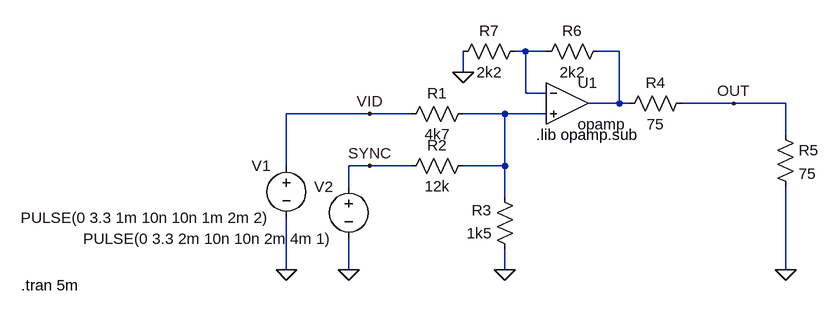
[diagram p0: schematic Video_Out.asc]
Video_Out.asc, the LTspice schematic file:
Version 4
SHEET 1 888 680
WIRE 432 -96 416 -96
WIRE 464 -96 432 -96
WIRE 576 -96 544 -96
WIRE 336 -64 336 -96
WIRE 432 -32 432 -96
WIRE 464 -32 432 -32
WIRE 576 -16 576 -96
WIRE 576 -16 528 -16
WIRE 592 -16 576 -16
WIRE 752 -16 672 -16
WIRE 832 -16 752 -16
WIRE 192 0 64 0
WIRE 256 0 192 0
WIRE 400 0 336 0
WIRE 464 0 400 0
WIRE 832 32 832 -16
WIRE 64 80 64 0
WIRE 192 80 160 80
WIRE 256 80 192 80
WIRE 400 80 400 0
WIRE 400 80 336 80
WIRE 160 112 160 80
WIRE 400 128 400 80
WIRE 64 240 64 160
WIRE 160 240 160 192
WIRE 400 240 400 208
WIRE 832 240 832 112
FLAG 64 240 0
FLAG 160 240 0
FLAG 400 240 0
FLAG 192 80 SYNC
FLAG 192 0 VID
FLAG 752 -16 OUT
FLAG 832 240 0
FLAG 336 -64 0
SYMBOL voltage 64 64 M0
WINDOW 123 0 0 Left 2
WINDOW 39 0 0 Left 2
SYMATTR InstName V1
SYMATTR Value PULSE(0 3.3 1m 10n 10n 1m 2m 2)
SYMBOL voltage 160 96 M0
WINDOW 123 0 0 Left 2
WINDOW 39 0 0 Left 2
SYMATTR InstName V2
SYMATTR Value PULSE(0 3.3 2m 10n 10n 2m 4m 1)
SYMBOL res 352 -16 R90
WINDOW 0 0 56 VBottom 2
WINDOW 3 32 56 VTop 2
SYMATTR InstName R1
SYMATTR Value 4k7
SYMBOL res 352 64 R90
WINDOW 0 0 56 VBottom 2
WINDOW 3 32 56 VTop 2
SYMATTR InstName R2
SYMATTR Value 12k
SYMBOL res 416 224 R180
WINDOW 0 36 76 Left 2
WINDOW 3 36 40 Left 2
SYMATTR InstName R3
SYMATTR Value 1k5
SYMBOL Opamps\\opamp 496 -80 R0
SYMATTR InstName U1
SYMBOL res 688 -32 R90
WINDOW 0 0 56 VBottom 2
WINDOW 3 32 56 VTop 2
SYMATTR InstName R4
SYMATTR Value 75
SYMBOL res 816 16 R0
SYMATTR InstName R5
SYMATTR Value 75
SYMBOL res 560 -112 R90
WINDOW 0 0 56 VBottom 2
WINDOW 3 32 56 VTop 2
SYMATTR InstName R6
SYMATTR Value 2k2
SYMBOL res 432 -112 R90
WINDOW 0 0 56 VBottom 2
WINDOW 3 32 56 VTop 2
SYMATTR InstName R7
SYMATTR Value 2k2
TEXT 448 32 Left 2 !.lib opamp.sub
TEXT -344 264 Left 2 !.tran 5m

The netlist it stands for:
* Video_Out.asc
V1 VID 0 PULSE(0 3.3 1m 10n 10n 1m 2m 2)
V2 SYNC 0 PULSE(0 3.3 2m 10n 10n 2m 4m 1)
R1 N003 VID 4k7
R2 N003 SYNC 12k
R3 0 N003 1k5
XU1 N001 N003 N002 opamp Aol=100K GBW=10Meg  ; pins invin noninvin out
R4 OUT N002 75
R5 OUT 0 75
R6 N002 N001 2k2
R7 N001 0 2k2
.lib opamp.sub
.tran 5m
.backanno
.end